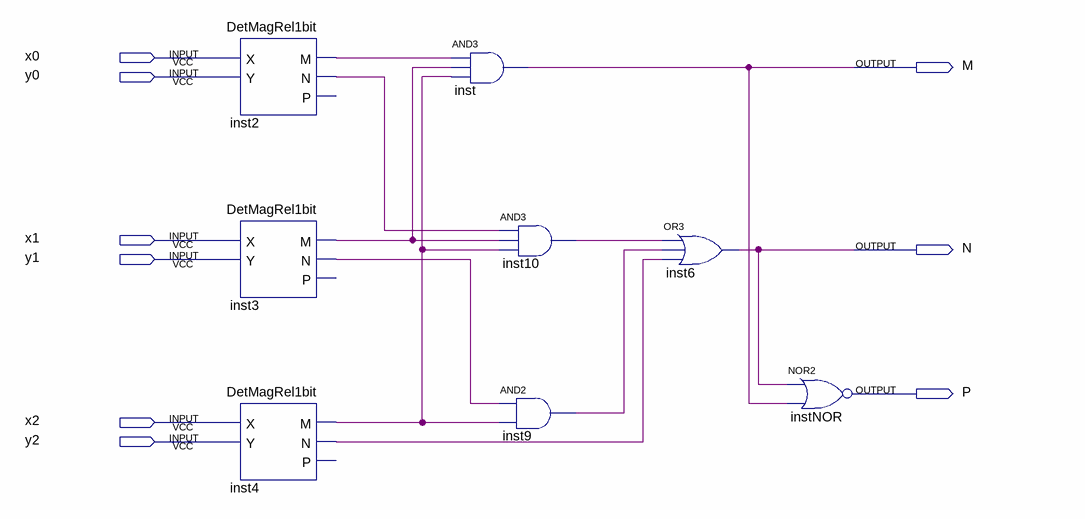
[diagram p0: schematic sheet]
// Quartus schematic DetMagRel3bit.bdf as structural Verilog: 8 symbols, 9 pins
module DetMagRel3bit (
  input  x0,
  input  y0,
  input  x1,
  input  y1,
  input  x2,
  input  y2,
  output M,
  output N,
  output P
);

  wire inst2_m, inst2_n, inst3_m, inst3_n, inst4_m, inst4_n, inst9_out, inst10_out;

  DetMagRel1bit inst2 (.X(x0), .Y(y0), .M(inst2_m), .N(inst2_n));  // open: P
  DetMagRel1bit inst3 (.X(x1), .Y(y1), .M(inst3_m), .N(inst3_n));  // open: P
  DetMagRel1bit inst4 (.X(x2), .Y(y2), .M(inst4_m), .N(inst4_n));  // open: P
  and inst (M, inst2_m, inst3_m, inst4_m);
  and inst10 (inst10_out, inst2_n, inst3_m, inst4_m);
  and inst9 (inst9_out, inst3_n, inst4_m);
  or inst6 (N, inst10_out, inst9_out, inst4_n);
  nor instNOR (P, N, M);
endmodule
